# EAGLE design front_light_via (EAGLE 9.0.0)
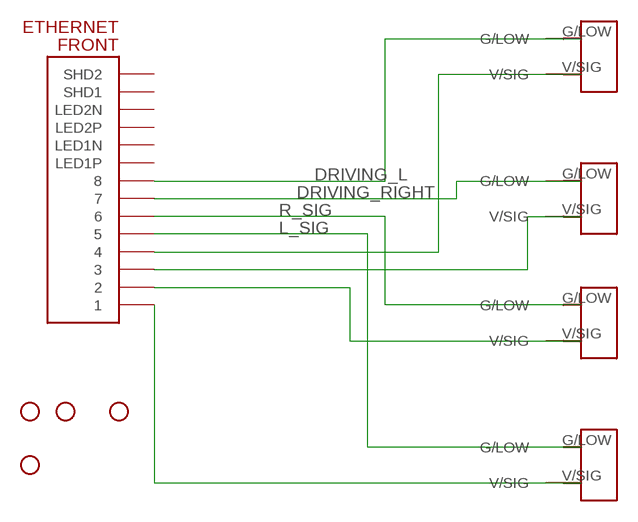
[diagram p0: schematic, sheet 1]

## Parts
FRONT  ETHERNET  [A122645-ND]
H1  STAND-OFF  [STAND-OFF]
H2  STAND-OFF  [STAND-OFF]
H3  STAND-OFF  [STAND-OFF]
H4  STAND-OFF  [STAND-OFF]
U$1  2_PIN_TECONNECTOR  [2_PIN_CONNECT]
U$2  2_PIN_TECONNECTOR  [2_PIN_CONNECT]
U$3  2_PIN_TECONNECTOR  [2_PIN_CONNECT]
U$4  2_PIN_TECONNECTOR  [2_PIN_CONNECT]

## Nets
DRIVING_L: FRONT.P$8 U$1.G/LOW
DRIVING_RIGHT: FRONT.P$7 U$2.G/LOW
L_SIG: FRONT.P$5 U$4.G/LOW
N$4: FRONT.P$4 U$1.V/SIG
N$5: FRONT.P$3 U$2.V/SIG
N$6: FRONT.P$2 U$3.V/SIG
N$7: FRONT.P$1 U$4.V/SIG
R_SIG: FRONT.P$6 U$3.G/LOW
Unconnected: FRONT.P$9(LED1N) FRONT.P$10(LED1P) FRONT.P$11(LED2N) FRONT.P$12(LED2P) FRONT.P$13(SHD1) FRONT.P$14(SHD2)

## Library data of the parts
FRONT = ETHERNET:ETHERNET: Ethernet port with 2 leds. digikey number A122645-ND
H1-H4 = SparkFun-Electromechanical:STAND-OFF: #4 Stand Off This is the mechanical footprint for a #4 phillips button head screw. Use the keepout ring to avoid running the screw head into surrounding components. SKU : PRT-00447
U$1-U$4 = TE 2-pin connector:2_PIN_TECONNECTOR: 2-pin connector for high power connections on board

## Board
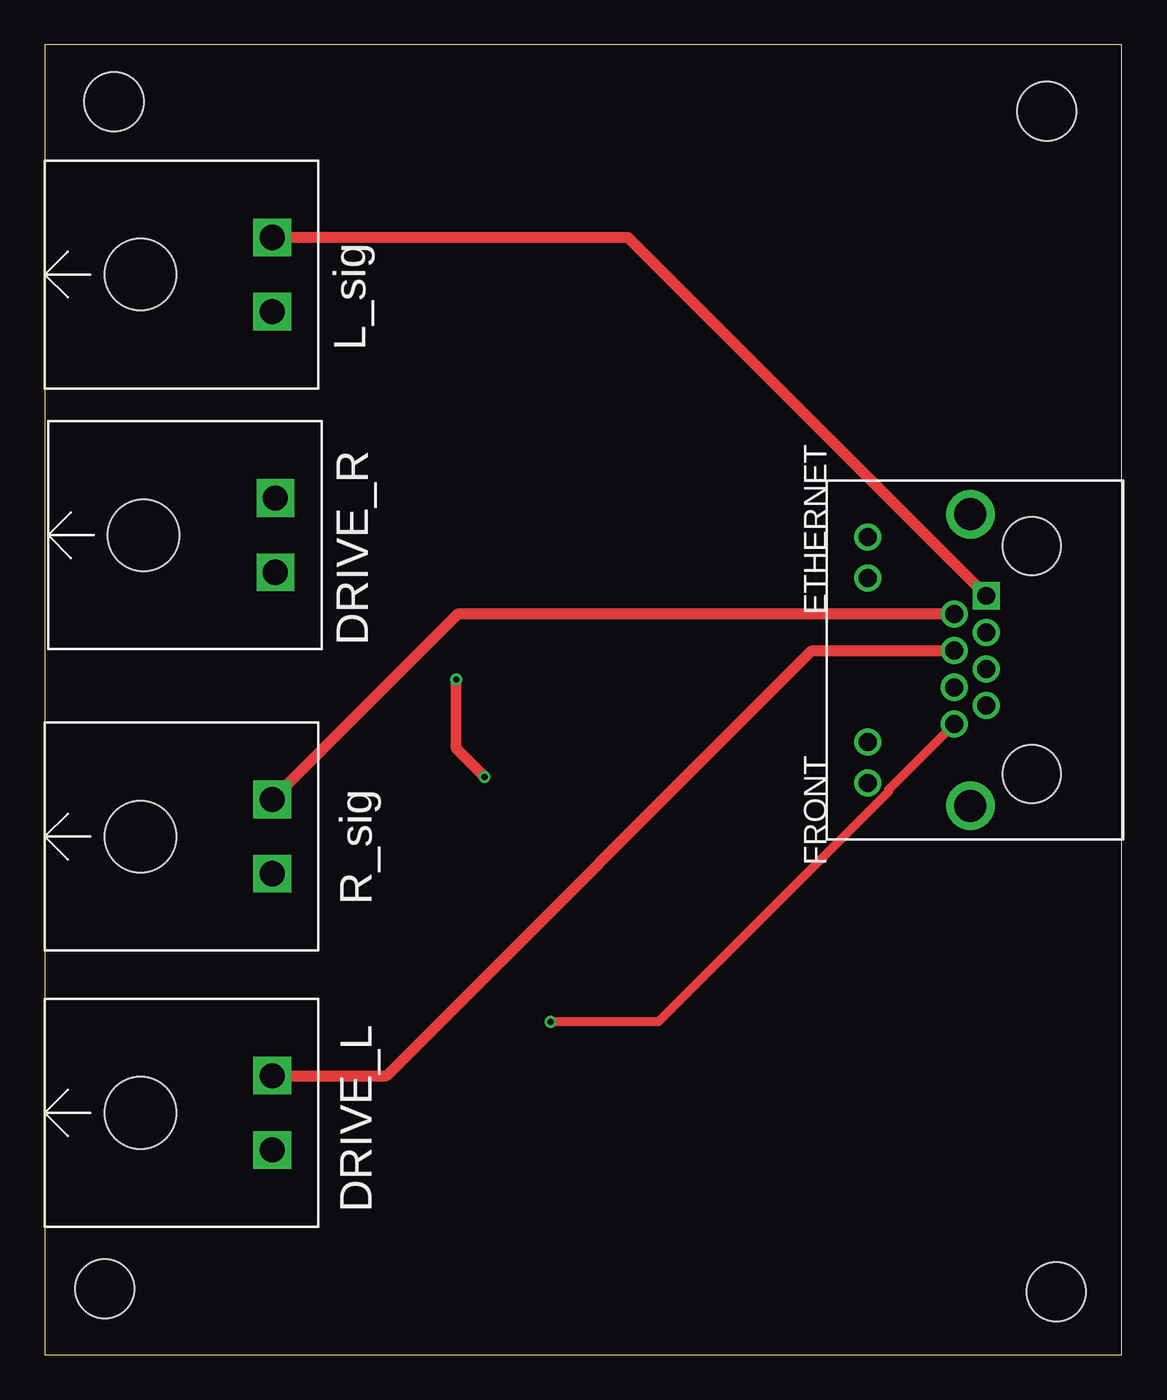
[diagram p1: board, top side]
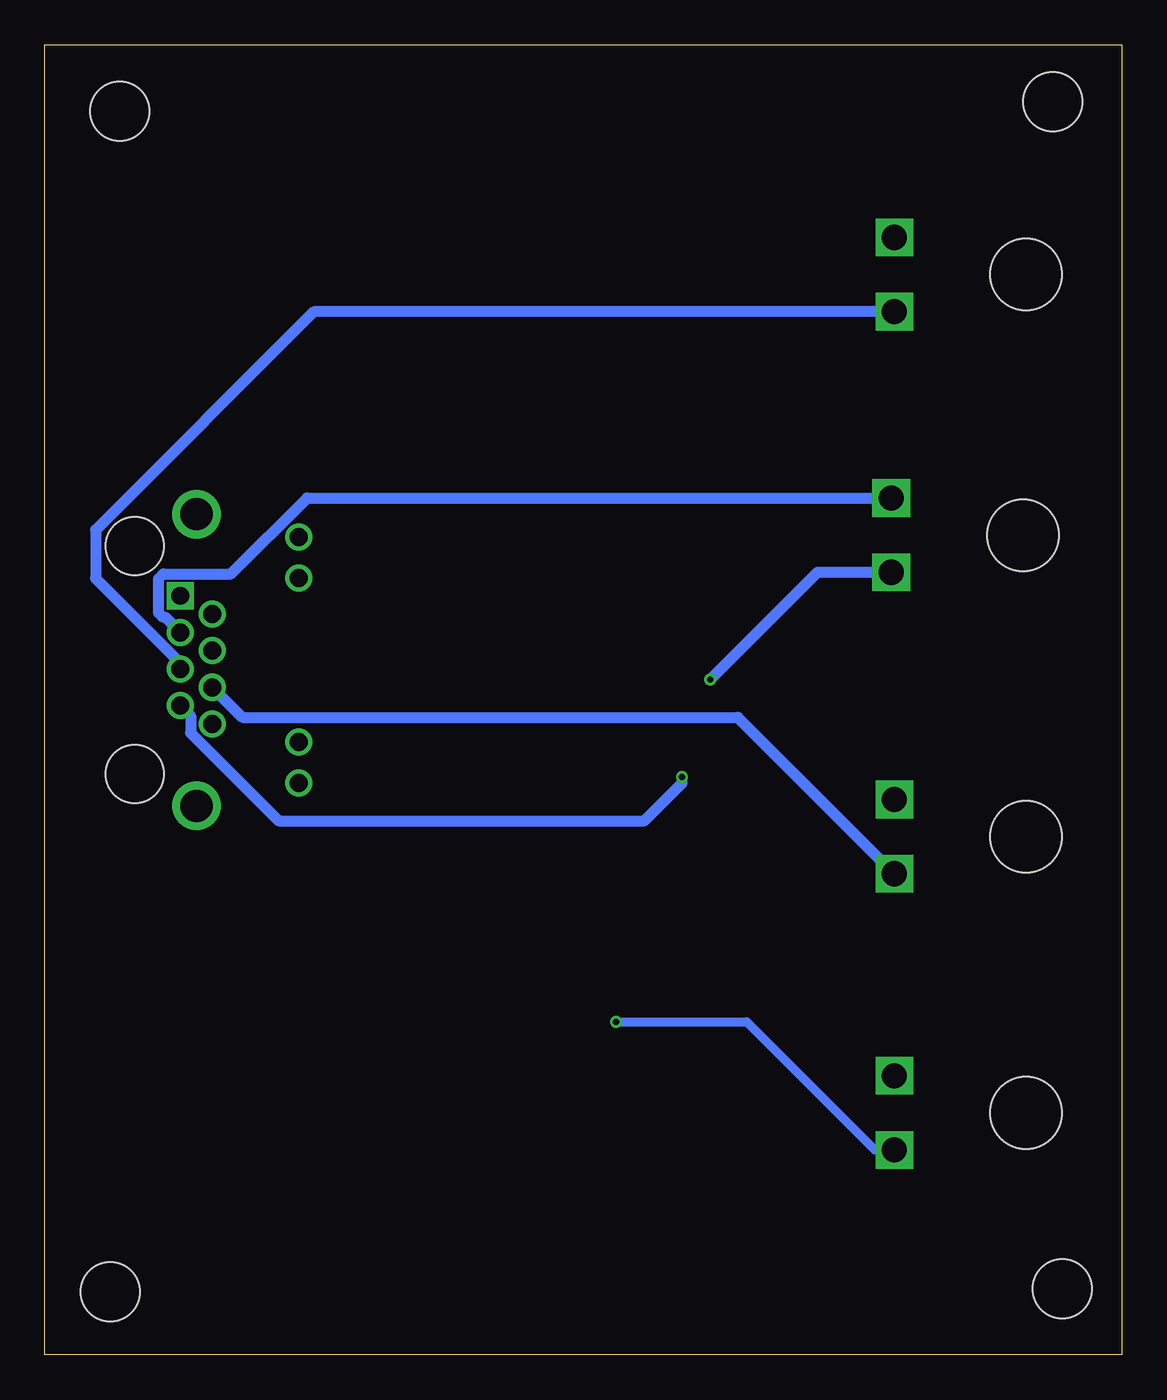
[diagram p2: board, bottom side, seen from below]

Size 60 x 73 mm. Coordinates in mm from the lower left corner, seen from the top.
Outline: 0,0 60,0 60,73 0,73 0,0
Copper layers (1*16): Top 0.035mm / dielectric 1.5mm / Bottom 0.035mm
Design rules "SeeedStudio_2layer_DRU_no_angle_20140221": minimum track width 6mil, minimum drill 12mil, track to track 6mil, track to pad 6mil, pad to pad 6mil, via to via 6mil, smd to smd 0mil, copper to edge 10mil, drill to drill 10mil, minimum pad ring 10mil, minimum via ring 6mil, stop-mask expansion 2mil, vias tented up to drill 100mil, thermal gap 10mil

### Footprints (pad centres in the part's own frame; a part is rotated, then mirrored left to right if it is on the bottom)
A122645-ND = drill 1 square: P$1 3.58,2.54 | drill 1: P$2 2.56,4.32; P$3 1.54,2.54; P$4 0.52,4.32; P$5 -0.5,2.54; P$6 -1.52,4.32; P$7 -2.54,2.54; P$8 -3.56,4.32; P$9 -6.86,9.14; P$10 -4.57,9.14; P$11 4.57,9.14; P$12 6.86,9.14 | drill 1.8: P$13 -8.13,3.43; P$14 8.13,3.43 | hole 3.25: -6.35,0; 6.35,0
STAND-OFF = hole 3.302: 0,0
2_PIN_CONNECT = drill 1.4 square: G/LOW 2.07,12.67; V/SIG -2.07,12.67 | hole 4: 0,5.33

### Placement (x,y rotation side)
FRONT  54.99,38.72 90 top
H1  3.33,3.67 0 top
H2  56.35,3.5 0 top
H3  3.85,69.83 0 top
H4  55.83,69.3 0 top
U$1  0,13.47 270 top
U$2  0.17,45.67 270 top
U$3  0,28.88 270 top
U$4  0,60.2 270 top

### Tracks (layer width: path | path; a pad name or v marks a point on that pad's centre or on a via)
DRIVING_L  (via drill 0.35)
  Top 0.508: FRONT.P$8 47.01,31.5 47.01,31.37 34.19,18.55 v28.18,18.55
  Bottom 0.508: v28.18,18.55 20.9,18.55 13.76,11.4 U$1.G/LOW
DRIVING_RIGHT  (via drill 0.35)
  Top 0.61: v24.5,32.2 22.93,33.77 v22.93,37.62
  Bottom 0.61: FRONT.P$7 51.88,35.61 51.88,34.65 46.98,29.75 26.6,29.75 24.5,31.85 v24.5,32.2 | v22.93,37.62 16.95,43.6 U$2.G/LOW
L_SIG
  Bottom 0.61: FRONT.P$5 52.45,38.54 57.17,43.27 57.17,45.97 45.01,58.13 U$4.G/LOW
N$4
  Top 0.61: U$1.V/SIG 19.05,15.54 42.73,39.23 FRONT.P$4
N$5
  Bottom 0.61: FRONT.P$3 53.28,41.08 53.39,41.08 53.66,41.35 53.66,43.24 53.39,43.51 49.63,43.51 45.39,47.74 U$2.V/SIG
N$6
  Top 0.61: FRONT.P$2 23,41.27 U$3.V/SIG
N$7
  Top 0.61: U$4.V/SIG 32.48,62.27 FRONT.P$1
R_SIG
  Bottom 0.61: FRONT.P$6 49,35.52 21.39,35.52 U$3.G/LOW

### Text on the board
tNames: L_sig | DRIVE_R | R_sig | DRIVE_L